# EAGLE design POE_PD_4_P-Schalter_minimized (EAGLE 6.5.0)
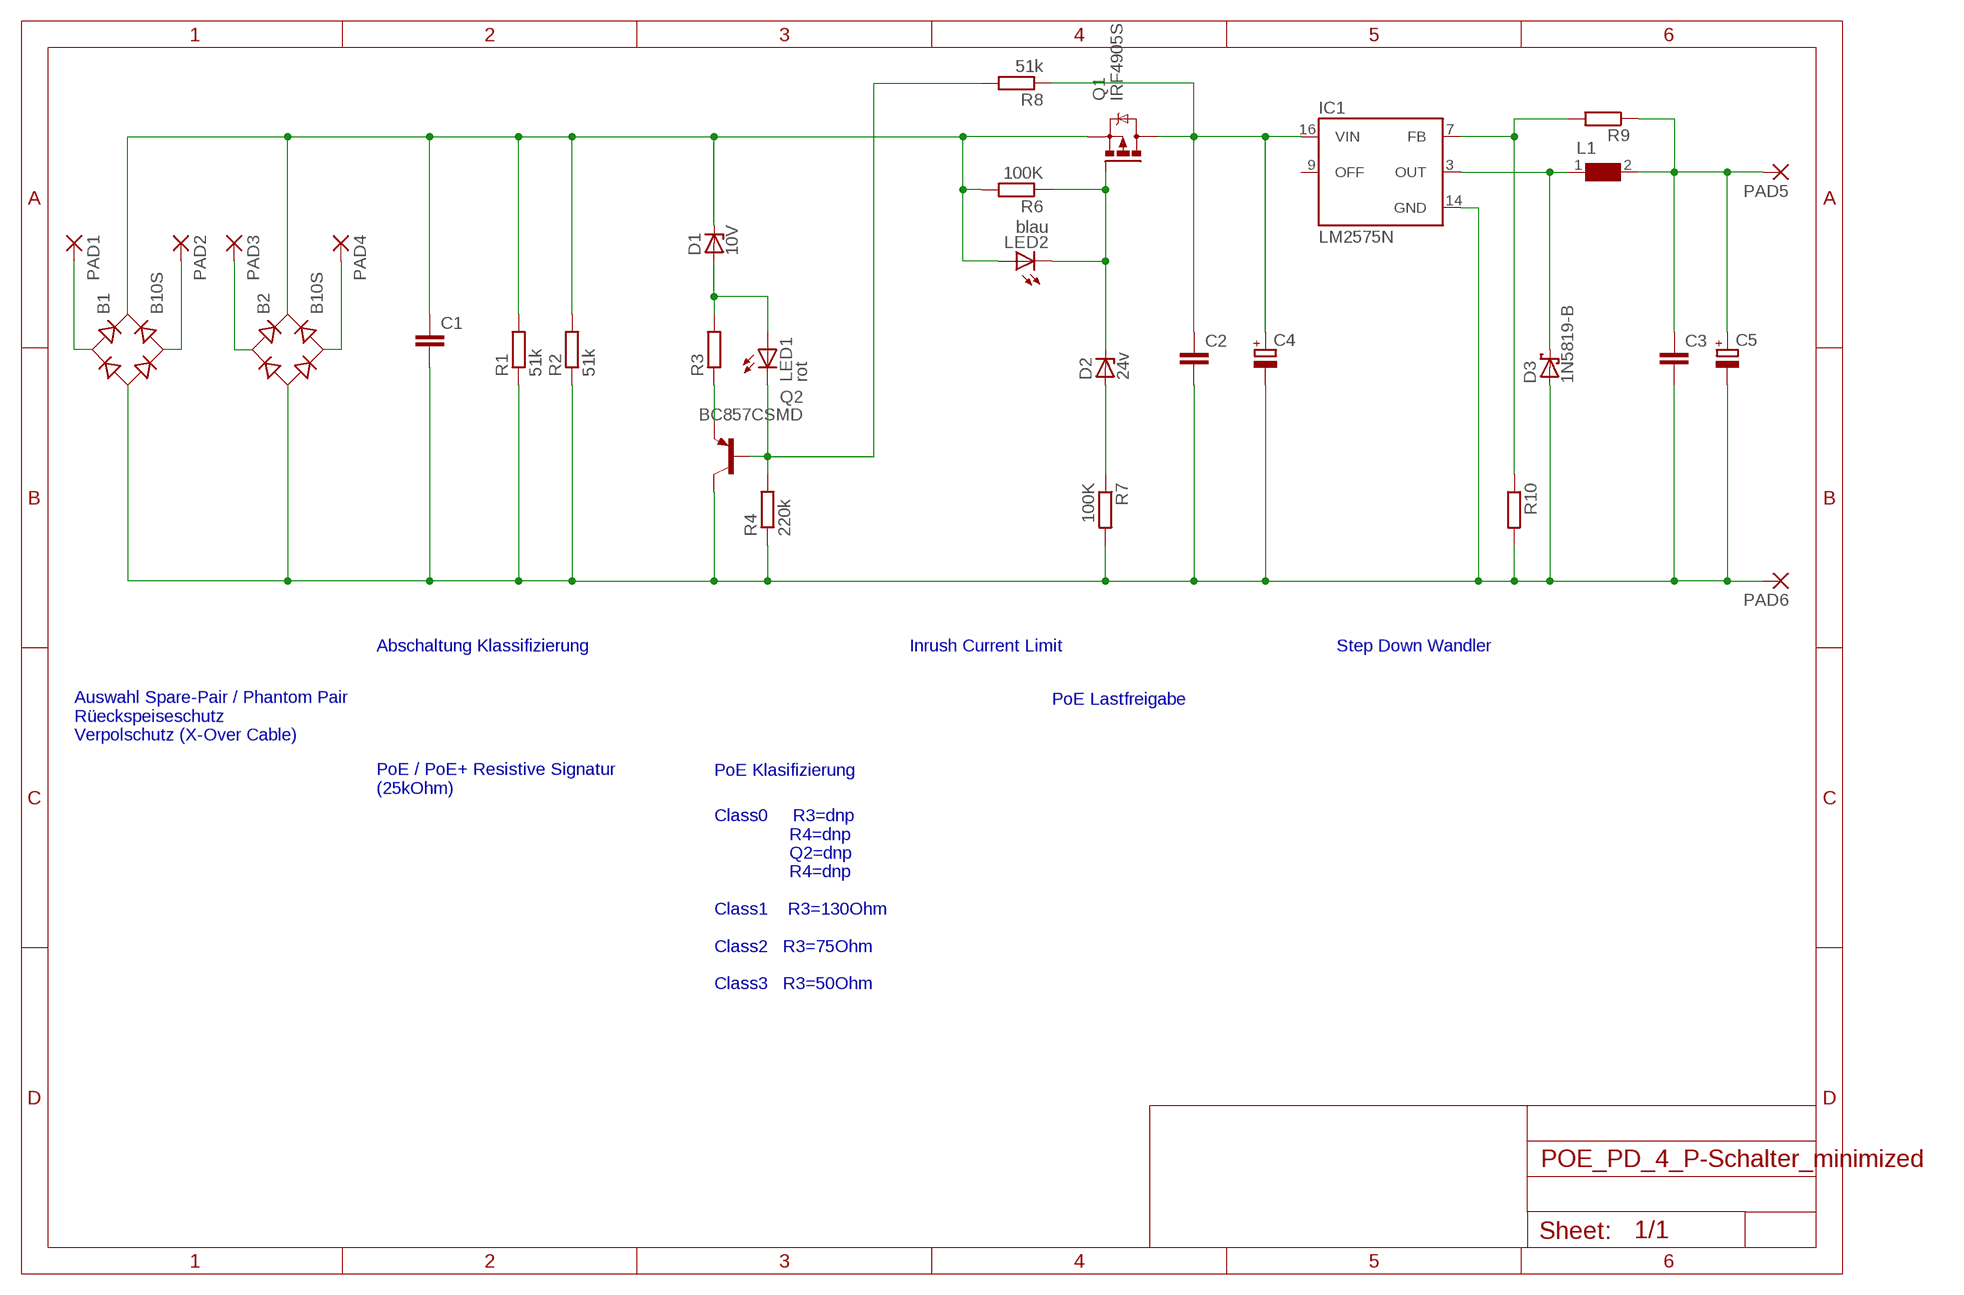
[diagram p0: schematic, sheet 1]

## Parts
B1  B10S  [MBS]
B2  B10S  [MBS]
C1  C-EUC0805  [C0805]
C2  C-EUC0805  [C0805]
C3  C-EUC0805  [C0805]
C4  CPOL-EUE2.5-5  [E2,5-5]
C5  CPOL-EUE2.5-5  [E2,5-5]
D1  10V  ZENER-DIODESOT23  [SOT23]
D2  24v  ZENER-DIODESOT23  [SOT23]
D3  1N5819-B  [DO41-7.6]
IC1  LM2575N  [DIL16]
L1  WE-PD2_S  [WE-PD2_S]
LED1  rot  LEDCHIP-LED0805  [CHIP-LED0805]
LED2  blau  LEDCHIP-LED0805  [CHIP-LED0805]
PAD1  2,15/1,0  [2,15/1,0]
PAD2  2,15/1,0  [2,15/1,0]
PAD3  2,15/1,0  [2,15/1,0]
PAD4  2,15/1,0  [2,15/1,0]
PAD5  2,15/1,0  [2,15/1,0]
PAD6  2,15/1,0  [2,15/1,0]
Q1  IRF4905S  IRFR5305  [D-PAK_TO252AA]
Q2  BC857CSMD  [SOT23-BEC]
R1  51k  R-EU_R0603  [R0603]
R2  51k  R-EU_R0603  [R0603]
R3  R-EU_0207/7  [0207/7]
R4  220k  R-EU_R0603  [R0603]
R6  100K  R-EU_R0603  [R0603]
R7  100K  R-EU_R0603  [R0603]
R8  51k  R-EU_R0603  [R0603]
R9  R-EU_0207/7  [0207/7]
R10  R-EU_0207/7  [0207/7]

## Nets
N$1: B1.- B2.- C1.2 C2.2 C3.2 C4.- C5.- D3.A IC1.14(GND) PAD6.1(P) Q2.C R1.1 R2.1 R4.1 R7.2 R10.2
N$4: Q2.E R3.1
N$5: B1.AC1 PAD1.1(P)
N$6: LED1.C Q2.B R4.2 R8.2
N$8: D1.1(A) LED1.A R3.2
N$9: D2.1(A) R7.1
N$10: B1.+ B2.+ C1.1 D1.3(C) LED2.A Q1.3(S) R1.2 R2.2 R6.2
N$11: D2.3(C) LED2.C Q1.1(G) R6.1
N$12: D3.C IC1.3(OUT) L1.1
N$13: C3.1 C5.+ L1.2 PAD5.1(P) R9.1
N$14: C2.1 C4.+ IC1.16(VIN) Q1.4(D) R8.1
N$15: IC1.7(FB) R9.2 R10.1
N$16: B1.AC2 PAD2.1(P)
N$17: B2.AC1 PAD3.1(P)
N$18: B2.AC2 PAD4.1(P)
Unconnected: IC1.9(OFF)

## Notes on the sheet
- Abschaltung Klassifizierung | Inrush Current Limit | Step Down Wandler
- PoE Lastfreigabe
- Auswahl Spare-Pair / Phantom Pair
  Rüeckspeiseschutz
  Verpolschutz (X-Over Cable)
- PoE Klasifizierung
- PoE / PoE+ Resistive Signatur
  (25kOhm)
- Class0     R3=dnp
                 R4=dnp
                 Q2=dnp
                 R4=dnp
  
  Class1    R3=130Ohm
  
  Class2   R3=75Ohm
  
  Class3   R3=50Ohm

## Library data of the parts
B1 B2 = rectifier:B*S: Surface Mount Glass Passivated Bridge Rectifiers Source: Comchip Bridge Rectifiers B05S-G_B10S-G.pdf
C1-C3 = rcl:C-EU: CAPACITOR, European symbol
C4 C5 = rcl:CPOL-EU: POLARIZED CAPACITOR, European symbol
D1 D2 = diode:ZENER-DIODE: Z-Diode
D3 = diode:1N581*: 1.0A SCHOTTKY BARRIER RECTIFIER Source: http://www.diodes.com/datasheets/ds23001.pdf
IC1 = v-reg-3:LM2575: National Semiconductor <http://www.national.com> 1.0A "Simple Switcher"(c) 52kHz, Vout 1.23-37V (HV: 57V), Vin 40V (HV: 60V), 50µA standby current
L1 = wuerth_elektronik_EAGLE:WE-PD2: SMD-Power Inductors WE-PD2 Is recommended for the application with switching regulators from National Semiconductor, Linear Technology, Texas Instruments and Fairchild Semiconductor -- Switching regulators with low operating voltages (computer, laptop, mobile phones, pagers) -- Integrated DC/DC-converter
LED1 LED2 = led:LED: LED OSRAM: - CHIPLED LG R971, LG N971, LY N971, LG Q971, LY Q971, LO R971, LY R971 LH N974, LH R974 LS Q976, LO Q976, LY Q976 LO Q996 - Hyper CHIPLED LW Q18S LB Q993, LB Q99A, LB R99A - SideLED LS A670, LO A670, LY A670, LG A670, LP A670 LB A673, LV A673, LT A673, LW A673 LH A674 LY A675 LS A676, LA A676, LO A676, LY A676, LW A676 LS A679, LY A679, LG A679 - Hyper Micro SIDELED® LS Y876, LA Y876, LO Y876, LY Y876 LT Y87S - SmartLED LW L88C, LW L88S LB L89C, LB L89S, LG L890 LS L89K, LO L89K, LY L89K LS L896, LA L896, LO L896, LY L896 - TOPLED LS T670, LO T670, LY T670, LG T670, LP T670 LSG T670, LSP T670, LSY T670, LOP T670, LYG T670 LG T671, LOG T671, LSG T671 LB T673, LV T673, LT T673, LW T673 LH T674 LS T676, LA T676, LO T676, LY T676, LB T676, LH T676, LSB T676, LW T676 LB T67C, LV T67C, LT T67C, LS T67K, LO T67K, LY T67K, LW E67C LS E67B, LA E67B, LO E67B, LY E67B, LB E67C, LV E67C, LT E67C LW T67C LS T679, LY T679, LG T679 LS T770, LO T770, LY T770, LG T770, LP T770 LB T773, LV T773, LT T773, LW T773 LH T774 LS E675, LA E675, LY E675, LS T675 LS T776, LA T776, LO T776, LY T776, LB T776 LHGB T686 LT T68C, LB T68C - Hyper Mini TOPLED® LB M676 - Mini TOPLED Santana® LG M470 LS M47K, LO M47K, LY M47K Source: http://www.osram.convergy.de LUXEON: - LUMILED® LXK2-PW12-R00, LXK2-PW12-S00, LXK2-PW14-U00, LXK2-PW14-V00 LXK2-PM12-R00, LXK2-PM12-S00, LXK2-PM14-U00 LXK2-PE12-Q00, LXK2-PE12-R00, LXK2-PE12-S00, LXK2-PE14-T00, LXK2-PE14-U00 LXK2-PB12-K00, LXK2-PB12-L00, LXK2-PB12-M00, LXK2-PB14-N00, LXK2-PB14-P00, LXK2-PB14-Q00 LXK2-PR12-L00, LXK2-PR12-M00, LXK2-PR14-Q00, LXK2-PR14-R00 LXK2-PD12-Q00, LXK2-PD12-R00, LXK2-PD12-S00 LXK2-PH12-R00, LXK2-PH12-S00 LXK2-PL12-P00, LXK2-PL12-Q00, LXK2-PL12-R00 Source: www.luxeon.com KINGBRIGHT: KA-3528ASYC Source: www.kingbright.com
PAD1-PAD6 = wirepad:2,15/1,0: THROUGH-HOLE PAD
Q1 = transistor-power:IRF?5305: HEXFET Power MOSFET Source: http://www.irf.com/product-info/datasheets/data/irfr5305pbf.pdf
Q2 = transistor-pnp:BC857*: PNP Transistror
R1-R4 R6-R10 = rcl:R-EU_: RESISTOR, European symbol

## Board
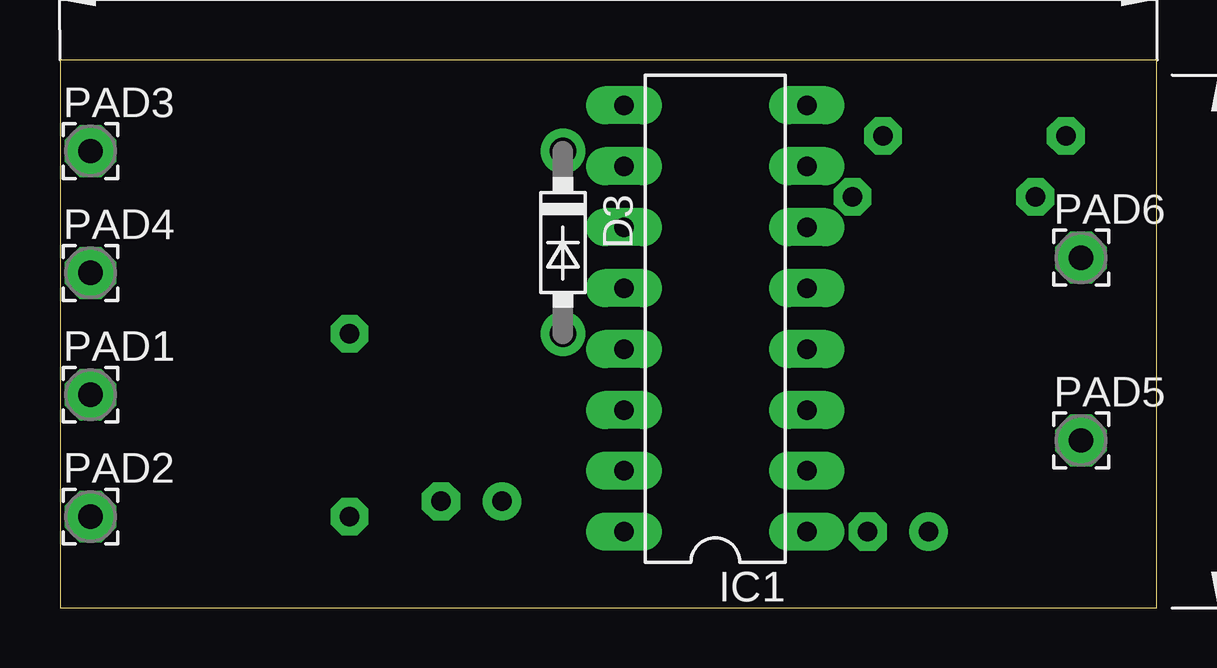
[diagram p1: board, top side]
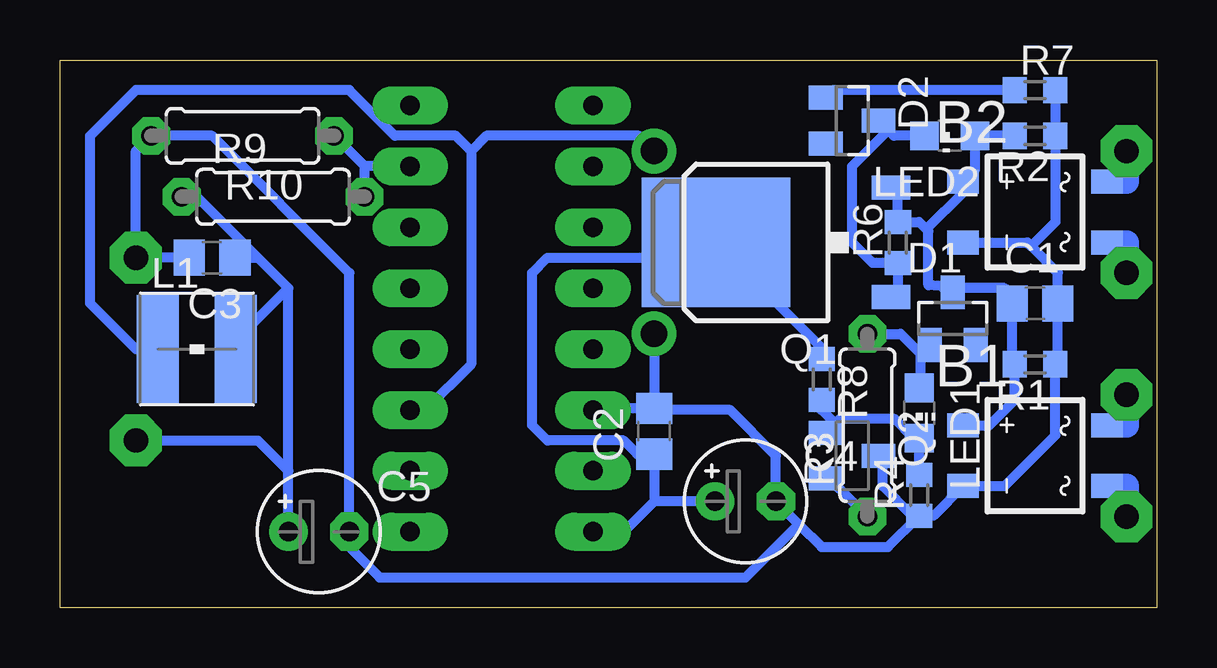
[diagram p2: board, bottom side, seen from below]

Size 45.71 x 22.85 mm. Coordinates in mm from the lower left corner, seen from the top.
Outline: 0,0 45.71,0 45.71,22.85 0,22.85 0,0
Copper layers (1*16): Top 0.035mm / dielectric 1.5mm / Bottom 0.035mm
Design rules "default *": minimum track width 10mil, minimum drill 0.6mm, track to track 8mil, track to pad 8mil, pad to pad 8mil, via to via 8mil, smd to smd 8mil, copper to edge 40mil, drill to drill 8mil, minimum pad ring 15mil, minimum via ring 8mil, stop-mask expansion 4mil, vias tented up to drill 0mil, thermal gap 10mil

### Footprints (pad centres in the part's own frame; a part is rotated, then mirrored left to right if it is on the bottom)
MBS = smd 1 x 1.3: + -1.27,-3; - 1.27,-3; AC1 -1.27,3; AC2 1.27,3
C0805 = smd 1.3 x 1.5: 1 -0.95,0; 2 0.95,0
E2,5-5 = drill 0.813 pad 1.6: + -1.27,0 | drill 0.813 pad 1.6 octagon: - 1.27,0
SOT23 = smd 1 x 1.4: 1 -0.95,-1.1; 2 0.95,-1.1; 3 0,1.1
DO41-7.6 = drill 1.1 pad 1.7: A 3.81,0; C -3.81,0
DIL16 = drill 0.813 long: 1 -8.89,-3.81; 2 -6.35,-3.81; 3 -3.81,-3.81; 4 -1.27,-3.81; 5 1.27,-3.81; 6 3.81,-3.81; 7 6.35,-3.81; 8 8.89,-3.81; 9 8.89,3.81; 10 6.35,3.81; 11 3.81,3.81; 12 1.27,3.81; 13 -1.27,3.81; 14 -3.81,3.81; 15 -6.35,3.81; 16 -8.89,3.81
WE-PD2_S = smd 1.75 x 4.5: 1 -1.625,0; 2 1.625,0
CHIP-LED0805 = smd 1.2 x 1.2: A 0,-1.05; C 0,1.05
2,15/1,0 = drill 1.016 pad 2.159 octagon: 1 0,0
D-PAK_TO252AA = smd 1 x 1.6: 1 -2.28,-4.8; 3 2.28,-4.8 | smd 5.4 x 6.2: 4 0,2.5
SOT23-BEC = smd 1 x 1.4: B -0.95,-1.1; C 0,1.1; E 0.95,-1.1
R0603 = smd 1 x 1.1: 1 -0.85,0; 2 0.85,0
0207/7 = drill 0.813 octagon: 1 -3.81,0; 2 3.81,0

### Placement (x,y rotation side)
B1  5.08,6.35 270 bottom
B2  5.08,16.51 270 bottom
C1  5.08,12.7 0 bottom
C2  20.95,7.37 90 bottom
C3  39.37,14.61 180 bottom
C4  17.14,4.45 0 bottom
C5  34.92,3.17 0 bottom
D1  8.51,12.06 0 bottom
D2  12.7,20.32 270 bottom
D3  20.95,15.24 270 top
IC1  27.3,12.06 90 top
L1  40.01,10.79 0 bottom
LED1  9.91,8.13 180 bottom
LED2  8.64,19.68 90 bottom
PAD1  1.27,8.89 0 top
PAD2  1.27,3.81 0 top
PAD3  1.27,19.05 0 top
PAD4  1.27,13.97 0 top
PAD5  42.55,6.98 0 top
PAD6  42.55,14.61 0 top
Q1  15.88,15.24 90 bottom
Q2  12.7,6.35 270 bottom
R1  5.08,10.16 180 bottom
R2  5.08,19.68 180 bottom
R3  12.06,7.62 90 bottom
R4  9.91,4.7 90 bottom
R6  10.79,15.24 90 bottom
R7  5.08,21.59 0 bottom
R8  13.97,9.53 270 bottom
R9  36.83,17.14 0 bottom
R10  38.1,19.68 180 bottom

### Tracks (layer width: path | path; a pad name or v marks a point on that pad's centre or on a via)
N$1
  Bottom 0.406: B2.- 5.4,15.24 5.24,15.08 | 5.24,15.08 4.13,13.97 C1.2 4.13,10.26 R1.1 4.23,7.2 6.35,5.08 B1.- 9.31,3.85 R4.1 | R4.1 10.2,3.85 11.43,5.08 11.43,6.18 Q2.C | 5.24,15.08 4.23,16.09 R2.1 R7.2 | 14.92,3.49 C4.- 15.88,6.35 17.78,8.26 20.89,8.26 C2.2 | 14.92,3.49 13.97,2.54 11.21,2.54 R4.1 | 20.89,8.89 C2.2 | 14.92,3.49 17.14,1.27 32.38,1.27 33.66,2.54 C5.- 33.66,13.97 39.37,19.68 R10.2 42.55,19.05 PAD6.1 C3.2 | D3.A C2.2 | C2.2 23.43,8.32 IC1.14
N$4
  Bottom 0.406: R3.1 13.16,4.91 Q2.E
N$5
  Bottom 1.016: B1.AC1 1.27,7.62 PAD1.1
N$6
  Bottom 0.406: R4.2 LED1.C 10.13,7.08 10.92,7.87 13.23,7.87 13.41,7.69 | 13.41,7.69 Q2.B | R8.2 13.97,8.26 13.41,7.69
N$8
  Bottom 0.406: LED1.A 9.84,9.62 9.84,10.58 | 9.84,10.58 D1.1 | R3.2 10.69,11.43 9.84,10.58
N$9
  Bottom 0.406: R7.1 13.48,21.59 D2.1
N$10
  Bottom 0.406: 5.93,9.77 R1.2 | R1.2 6.03,10.26 C1.1 6.03,13.01 6.35,13.33 8.76,13.33 8.83,13.4 | B1.+ 6.99,7.62 5.93,8.68 R1.2 | 8.83,13.4 9.53,13.46 9.53,15.7 9.61,15.79 | D1.3 8.89,13.33 8.83,13.4 | Q1.3 10.79,17.24 R6.2 9.91,16.09 9.61,15.79 | 9.61,15.79 8.08,17.32 B2.+ 7.59,18.27 LED2.A R2.2
N$11
  Bottom 0.406: Q1.1 10.79,13.24 R6.1 11.85,14.39 12.7,15.24 12.7,18.41 11.2,19.92 | LED2.C 10.96,19.68 11.2,19.92 | 11.2,19.92 D2.3
N$12
  Bottom 0.406: D3.C 21.59,19.68 27.94,19.68 28.57,19.05 | 28.57,19.05 28.57,10.16 30.48,8.26 IC1.3 | 28.57,19.05 29.21,19.68 31.75,19.68 33.66,21.59 42.55,21.59 44.45,19.68 44.45,12.7 42.55,10.79 L1.1
N$13
  Bottom 0.406: C5.+ 36.2,5.71 | 36.2,5.71 36.2,13.33 | 36.2,13.33 37.47,14.61 | 37.47,14.61 40.01,17.14 R9.1 | C3.1 37.47,14.61 | L1.2 38.38,11.15 36.2,13.33 | PAD5.1 37.47,6.98 36.2,5.71
N$14
  Bottom 0.406: R8.1 13.97,10.83 Q1.4 19.01,14.61 25.4,14.61 26.04,13.97 26.04,7.62 25.4,6.98 22.23,6.98 21.66,6.42 C2.1 20.95,4.45 | 20.95,4.45 22.23,3.17 IC1.16 | C4.+ 20.95,4.45
N$15
  Bottom 0.406: IC1.7 33.02,18.41 | 33.02,18.41 R10.1 | R9.2 33.02,18.41
N$16
  Bottom 1.016: B1.AC2 1.27,5.08 PAD2.1
N$17
  Bottom 1.016: B2.AC1 1.27,17.78 PAD3.1
N$18
  Bottom 1.016: B2.AC2 1.27,15.24 PAD4.1